# Altium schematic sheet EMG_schemqtic.SchDoc
size 420 x 297 mm; SheetNumber: 1; SheetTotal: 1
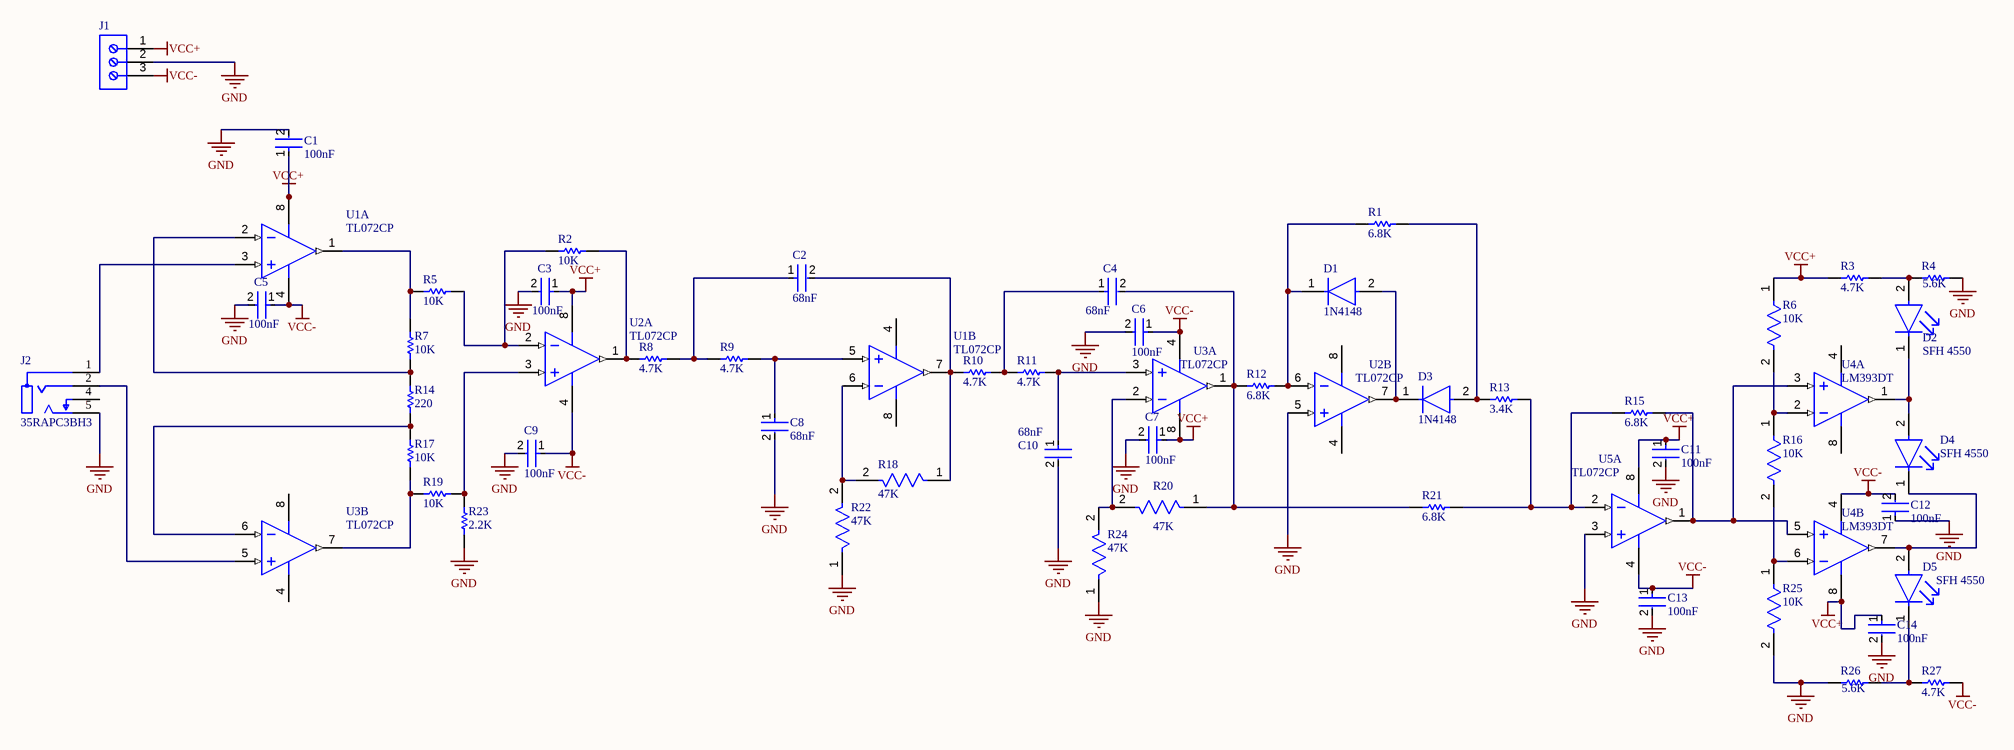
[diagram p0: EMG_schemqtic.SchDoc]

## Parts
C1  100nF  [FP-CGA3E-0_3-0_1-IPC_A]
C2  68nF  [FP-1206-L_3_2_0_2-W_1_6_0-IPC_A]
C3  100nF  [FP-CGA3E-0_3-0_1-IPC_A]
C4  68nF  [FP-1206-L_3_2_0_2-W_1_6_0-IPC_A]
C5  100nF  [FP-CGA3E-0_3-0_1-IPC_A]
C6  100nF  [FP-CGA3E-0_3-0_1-IPC_A]
C7  100nF  [FP-CGA3E-0_3-0_1-IPC_A]
C8  68nF  [FP-1206-L_3_2_0_2-W_1_6_0-IPC_A]
C9  100nF  [FP-CGA3E-0_3-0_1-IPC_A]
C10  68nF  [FP-1206-L_3_2_0_2-W_1_6_0-IPC_A]
C11  100nF  [FP-CGA3E-0_3-0_1-IPC_A]
C12  100nF  [FP-CGA3E-0_3-0_1-IPC_A]
C13  100nF  [FP-CGA3E-0_3-0_1-IPC_A]
C14  100nF  [FP-CGA3E-0_3-0_1-IPC_A]
D1  1N4148  [FP-017AG-MFG]
D2  SFH 4550  [FP-SFH_4550-MFG]
D3  1N4148  [FP-017AG-MFG]
D4  SFH 4550  [FP-SFH_4550-MFG]
D5  SFH 4550  [FP-SFH_4550-MFG]
J1  691709710303  [691709710303]  (value not drawn)
J2  35RAPC3BH3  [FP-35RAPC3BH3-MFG]
R1  6.8K  [RESC1609X50X30LL10T20]
R2  10K  [RESC1609X50X30NL8T20]
R3  4.7K  [RESC2013X70X40NL20T20]
R4  5.6K  [RESC1005X40X25LL05T05]
R5  10K  [RESC1609X50X30NL8T20]
R6  10K  [FP-MCT0603-IPC_C]
R7  10K  [RESC1609X50X30NL8T20]
R8  4.7K  [RESC1005X40X25LL05T05]
R9  4.7K  [RESC1005X40X25LL05T05]
R10  4.7K  [RESC1005X40X25LL05T05]
R11  4.7K  [RESC1005X40X25LL05T05]
R12  6.8K  [RESC1609X50X30LL10T20]
R13  3.4K  [RESC1609X50X30LL10T20]
R14  220  [RESC2013X70X40NL20T20]
R15  6.8K  [RESC1609X50X30LL10T20]
R16  10K  [FP-MCT0603-IPC_C]
R17  10K  [RESC1609X50X30NL8T20]
R18  47K  [FP-CRCW0603-e3-IPC_B]
R19  10K  [RESC1609X50X30NL8T20]
R20  47K  [FP-CRCW0603-e3-IPC_B]
R21  6.8K  [RESC1609X50X30LL10T20]
R22  47K  [FP-CRCW0603-e3-IPC_B]
R23  2.2K  [RESC1608X55X25LL10T15]
R24  47K  [FP-CRCW0603-e3-IPC_B]
R25  10K  [FP-MCT0603-IPC_C]
R26  5.6K  [RESC1005X40X25LL05T05]
R27  4.7K  [RESC2013X70X40NL20T20]
U1  TL072CP  [P0008A]  (parts A,B of 2)
U2  TL072CP  [P0008A]  (parts A,B of 2)
U3  TL072CP  [P0008A]  (parts A,B of 2)
U4  LM393DT  [STM-SO-8_D_L]  (parts A,B of 2)
U5  TL072CP  [P0008A]  (part A of 2)

## Nets
GND: C1.2 C3.2 C5.2 C6.2 C7.2 C8.2 C9.2 C10.2 C11.2 C12.1 C13.2 C14.2 J1.2 J2.5 R4.2 R22.1 R23.1 R24.1 R25.2 R26.1 U2.5(IN2+) U5.3(IN1+)
VCC+: C1.1 C3.1 C7.1 C11.1 C14.1 J1.1 R3.1 R6.1 U1.8(VCC+) U2.8(VCC+) U3.8(VCC+) U4.8(VCC+) U5.8(VCC+)
VCC-: C5.1 C6.1 C9.1 C12.2 C13.1 J1.3 R27.2 U1.4(VCC-) U2.4(VCC-) U3.4(VCC-) U4.4(VCC-) U5.4(VCC-)
NetC2_1: C2.1 R8.2 R9.1
NetC2_2: C2.2 R10.1 R18.1 U1.7(OUT2)
NetC4_1: C4.1 R10.2 R11.1
NetC4_2: C4.2 R12.1 R20.1 R21.1 U3.1(OUT1)
NetC8_1: C8.1 R9.2 U1.5(IN2+)
NetC10_1: C10.1 R11.2 U3.3(IN1+)
NetD1_1: D1.1(C) R1.1 R12.2 U2.6(IN2-)
NetD1_2: D1.2(A) D3.1(C) U2.7(OUT2)
NetD2_1: D2.1(C) D4.2(A) U4.1(OUT1)
NetD2_2: D2.2(A) R3.2 R4.1
NetD3_2: D3.2(A) R1.2 R13.1
NetD4_1: D4.1(C) D5.2(A) U4.7(OUT2)
NetD5_1: D5.1(C) R26.2 R27.1
NetJ2_1: J2.1 U1.3(IN1+)
NetJ2_2: J2.2 U3.5(IN2+)
NetR2_1: R2.1 R8.1 U2.1(OUT1)
NetR2_2: R2.2 R5.1 U2.2(IN1-)
NetR5_2: R5.2 R7.2 U1.1(OUT1)
NetR6_2: R6.2 R16.1 U4.2(IN1-)
NetR7_1: R7.1 R14.2 U1.2(IN1-)
NetR13_2: R13.2 R15.1 R21.2 U5.2(IN1-)
NetR14_1: R14.1 R17.2 U3.6(IN2-)
NetR15_2: R15.2 U4.3(IN1+) U4.5(IN2+) U5.1(OUT1)
NetR16_2: R16.2 R25.1 U4.6(IN2-)
NetR17_1: R17.1 R19.2 U3.7(OUT2)
NetR18_2: R18.2 R22.2 U1.6(IN2-)
NetR19_1: R19.1 R23.2 U2.3(IN1+)
NetR20_2: R20.2 R24.2 U3.2(IN1-)

Not connected (* = marked no-connect by the designer): J2 4

## Notes on the sheet
- THIS DOCUMENT AND THE DATA DISCLOSED HEREIN OR
- HEREWITH IS THE PROPERTY OF ALTIUM LIMITED AND MAY
- DWG NO:
- REVISION
- REV:
- DESCRIPTION
- DATE
- APPROVED
- BE FREELY DISTRIBUTED IN WHOLE. NO RIGHTS ARE
- RESERVED OR EXPRESS OR IMPLIED WARANTEE GIVEN.
- ENG:
- APPROVALS
- PROJECT
- DSN:
- CHK:
- REFERENCE DOCUMENTS
- PROJECT REVISION:
- TITLE
- DOCUMENT REVISION:
- DESIGN ITEM:
- BOM:
- FAB DWG:
- PCB DWG:
- ASSY DWG:
- SCALE:
- A3
- SIZE
- CAGE CODE
- FILE NAME
- DWG NO.
- SHEET
- OF
- REV

## Library data of the parts
C1 C3 C5-C7 C9 C11-C14 = CMP-2000-07546-2: Cap Ceramic 100nF 50V X7R 10% Pad SMD 0603 +125°C Automotive T/R; Weight: 7.1E-05oz; Composition: Ceramic; Max Operating Temperature: 125°C; Termination: SMD/SMT; Dielectric: X7R; Length: 1.6mm; Package Quantity: 1; REACH SVHC: No SVHC; Lead Free: Lead Free; Case Code (Metric): 1608; Min Operating Temperature: -55°C; Packaging: Tape and Reel; Tolerance: 10%; Voltage Rating: 50V; Case Code (Imperial): 0603; Capacitance: 100nF; Case/Package: 0603; Voltage Rating (DC): 50V; Depth: 0.8mm; Radiation Hardening: No; Ratings: AEC-Q200; Mount: Surface Mount; Voltage: 50V; Thickness: 0.035inch; Width: 0.8mm; Height: 0.8mm
C2 C4 C8 C10 = CMP-04427-019044-1: General Purpose Ceramic Capacitor, 1206, 68nF, 10%, X7R, 15%, 100V; Dissipation Factor: 2.5%; Construction: Flat; Packaging: Tape and Reel; Min Operating Temperature: -55°C; Package Quantity: 1; Voltage Rating (DC): 100V; Mount: Surface Mount; RoHS Compliant: Yes; Case/Package: 1206; Thickness: 0.037inch; Case Code (Imperial): 1206; Case Code (Metric): 3216; Max Operating Temperature: 125°C; Depth: 1.6mm; Length: 3.2mm; Series: -; REACH SVHC: No SVHC; Voltage: 100V; Number of Pins: 2; Width: 0.063inch; Voltage Rating: 100V; Capacitance: 68nF; Height: 0.94mm; Radiation Hardening: No; Lead Free: Lead Free; Termination: SMD/SMT; Tolerance: 10%; Dielectric: X7R
D1 D3 = CMP-07163-000046-1: DIODE GEN PURP 100V 200MA DO35; Forward Voltage: 1V; Max Power Dissipation: 500mW; Max Reverse Current: 5uA; Forward Current: 300mA; Current: 4A; Reverse Recovery Time: 4ns; Element Configuration: Single; Outside Diameter: 1.85mm; Capacitance: 4pF; Polarity: Standard; Max Forward Surge Current (Ifsm): 1A; Reverse Voltage: 100V; Output Current: 200mA; Average Rectified Current: 200mA; Diameter: 1.91mm; Max Repetitive Reverse Voltage (Vrrm): 100V; Current Rating: 200mA; Case/Package: DO-35; Lead Free: Lead Free; Number of Pins: 2; Recovery Time: 4ns; Packaging: Bulk; Contact Plating: Tin; Voltage: 100V; Mount: Through Hole; Max Surge Current: 4A; Package Quantity: 2000; Width: 1.91mm; Max Reverse Voltage (DC): 100V; Length: 4.56mm; Radiation Hardening: No; Power Dissipation: 500mW; Voltage Rating (DC): 100V; Peak Non-Repetitive Surge Current: 4A; REACH SVHC: No SVHC; Height: 4.56mm; Max Operating Temperature: 175°C; Series: -; Weight: 0.01lb; Min Operating Temperature: -65°C
D2 D4 D5 = CMP-62016-000011-1: EMITTER IR 860NM 100MA RADIAL; Manufacturer: Osram Opto; Forward Voltage: 1.5V; Reverse Voltage: 5V; Viewing Angle: 6°; Led Orientation: Straight; Colour: Infrared; Mouser Description: Infrared Emitters - High Power Infrared 850 nm HALF ANGLE +/-3DEG; RoHS: TRUE; Manufacturer Part Number: SFH 4550; Forward Current: 100mA; Octopart: https://octopart.com/sfh+4550-osram+opto-55410894; ComponentLink2Description: Datasheet; Lead Free: Yes; Temperature: -40°C to +100°C; ComponentLink2URL: https://dammedia.osram.info/media/resource/hires/osram-dam-5580407/SFH%204550_EN.pdf; Device Class L2: LEDs; Temperature Range Low: -40°C; Digikey Description: EMITTER IR 860NM 100MA RADIAL; Temperature Range High: +100°C; Device Class L3: unset; Peak Emmision Wavelength: 860nm; Category: Diode; Package: SFH 4550; Device Class L1: Optoelectronics; Automotive: No
J1 = CMP-1502-03336-2: Battery connector; NexarPartId: 34171770; Number of Contacts: 3; Voltage Rating: 300V; Connector Type: Screw; Current Rating: 6A; Wire/Cable Gauge: 30AWG; Plating: Steel; Number of Levels: 1; Wire Gauge (Min): 14AWG; Pitch: 5mm; Termination: Screw; Contact Plating: Tin; Max Operating Temperature: 130°C; Color: Black; RoHS: Compliant; Contact Material: Nickel; Number of Pins: 3; Packaging: Digi-Reel®; REACH SVHC: Unknown; Mount: Surface Mount; Lead Pitch: 5mm; Number of Positions Per Level: 3; Flammability Rating: UL94 V-0; Length: 15mm; Number of Positions: 3; Current: 6A; Min Operating Temperature: -40°C; Number of Rows: 1; Wire Gauge (Max): 30AWG; Housing Material: Nylon; Height: 10.2mm; Voltage: 300V
J2 = CMP-47983-000003-1: CONN JACK STEREO 3.5MM R/A; Gender: Female; Number of Positions: 3; Body Color: Black; Number of Ports: 1; Voltage Rating: 500V; Shielding: Unshielded; Body Material: Brass; Orientation: Right Angle; RoHS Compliant: Yes; Termination: Solder; Lead Free: Lead Free; Package Quantity: 1; Series: 35; Housing Material: PBT; Color: Black; Packaging: Bulk; Contact Plating: Silver; Mount: Through Hole; Contact Material: Copper Alloy; Number of Terminals/Pins: 3
R1 R12 R15 R21 = CMP-2000-03550-1: Part Number: CRCW06036K80FKEA; Manufacturer: Vishay Dale
R2 R5 R7 R17 R19 = CMP-1666-00005-4: Chip Resistor, 10 KOhm, +/- 1%, 100 mW, -55 to 155 degC, 0603 (1608 Metric), RoHS, Tape and Reel; Manufacturer: Vishay Semiconductor; Voltage Rating: 75 V; Max Operating Temperature: 155 degC; PackageDescription: 2-Pin Surface Mount Device, Body 1.575 x 0.85 mm; ComponentLink1Description: Manufacturer URL; RoHSCompliant: true; PackageReference: 0603; REACH SVHC: Unknown; Length: 1.55 mm; DatasheetVersion: 06/2012; Packaging: Tape and Reel; Min Operating Temperature: -55 degC; Mounting Technology: Surface Mount; ComponentLink2URL: https://datasheet.ciiva.com/11809/0900766b80d98afc-11809037.pdf; Height: 0.45 mm; ComponentLink2Description: Datasheet; Package Quantity: 5000; ComponentLink1URL: http://www.vishay.com/
R3 R27 = CMP-2001-00550-5: Chip Resistor, 4.7 KOhm, +/- 1%, 0.125 W, -55 to 155 degC, 0805 (2012 Metric), RoHS, Tape and Reel; Manufacturer: Panasonic; Voltage Rating: 150 V; Min Operating Temperature: -55 degC; PackageReference: 0805; Mounting Technology: Surface Mount; Height: 0.6 mm; PackageDescription: 2-Pin Surface Mount Device, Body 2 x 1.25 mm; RoHSCompliant: true; Length: 2 mm; REACH SVHC: Yes; Packaging: Tape and Reel; Pins: 2; Mount: Surface Mount; ComponentLink2Description: Datasheet; ComponentLink1URL: http://www.panasonic.com/; ComponentLink1Description: Manufacturer URL; DatasheetVersion: 04/2015; Package Quantity: 5000; ComponentLink2URL: http://industrial.panasonic.com/cdbs/www-data/pdf/RDA0000/AOA0000C86.pdf; Max Operating Temperature: 155 degC
R4 R26 = CMP-2002-00121-1: Manufacturer: Vishay Dale; Part Number: CRCW04025K60FKED
R6 R16 R25 = CMP-02407-000418-1: RES SMD 100 OHM 1% 1/8W 0603; Voltage Rating: 75V; Power Rating: 100mW; Temperature Coefficient: 50ppm/°C; Max Power Dissipation: 125mW; Resistance: 10kR; Case/Package: 0603; Military Standard: Not; Min Operating Temperature: -55°C; Width: 0.8mm; Package Quantity: 1; Max Operating Temperature: 125°C; Tolerance: 1%; Depth: 0.85mm; Radiation Hardening: No; Mount: Surface Mount; Composition: Thin Film; Contact Plating: Tin; Lead Free: Lead Free; Case Code (Imperial): 0603; Number of Terminations: 2; Voltage Rating (DC): 75V; Length: 1.55mm; Packaging: Tape and Reel; Height: 0.022inch; Case Code (Metric): 1608
R8-R11 = CMP-2002-01154-4: Chip Resistor, 4.7 KOhm, +/- 1%, 0.1 W, -55 to 155 degC, 0402 (1005 Metric), RoHS, Tape and Reel; PartNumber: ERJ-2RKF4701X; Voltage Rating: 50 V; Case\/Package: 0402; Power Rating: 100 mW; Height: 0.35 mm; Mounting Technology: Surface Mount; REACH SVHC: Yes; Resistance: 4.7 KOhm; Max Operating Temperature: 155 degC; ComponentLink1Description: Manufacturer URL; ComponentLink2Description: Datasheet; Pins: 2; PackageReference: 0402; Tolerance: 1%; Case Code (Imperial): 0402; Length: 1 mm; PackageDescription: 2-Pin Surface Mount Device, Body 1 x 0.5 mm; RoHSCompliant: true; Package Quantity: 1; Radiation Hardening: No; DatasheetVersion: 04/2015; Width: 0.5 mm; Case Code (Metric): 1005; Mount: Surface Mount; ComponentLink1URL: http://www.panasonic.com/; Min Operating Temperature: -55 degC; Packaging: Cut Tape; ComponentLink2URL: http://industrial.panasonic.com/cdbs/www-data/pdf/RDA0000/AOA0000C86.pdf
R13 = CMP-2000-03303-1: Manufacturer: Vishay Dale; Part Number: CRCW06033K40FKEA
R14 = CMP-2001-00044-1: Part Number: ERJ6ENF2200V; Manufacturer: Panasonic
R18 R20 R22 R24 = CMP-2000-03379-3: RES SMD 47K OHM 1% 1/10W 0603; Voltage Rating: 75V; Max Power Dissipation: 100mW; Resistance: 47kR; Temperature Coefficient: 100ppm/°C; Size Code: 0603; Technology: THICK FILM; Case Code (Metric): 1608; Radiation Hardening: No; Case/Package: 0603; Number of Terminations: 2; Package Quantity: 5000; Width: 0.85mm; Series: CRCW; RoHS Compliant: Yes; Case Code (Imperial): 0603; Lead Free: Lead Free; Resistance Tolerance: 1%; Depth: 0.85mm; Contact Plating: Tin; Tolerance: 1%; Voltage Rating (DC): 75V; Min Operating Temperature: -55°C; Mount: Surface Mount; Packaging: Tape and Reel; Length: 1.55mm; Resistor Type: Thick Film; Features: Automotive AEC-Q200; Max Operating Temperature: 155°C; Weight: 7.1E-05oz; Construction: Rectangular; Height: 0.45mm; Military Standard: Not; Termination: SMD/SMT; Power Rating: 100mW
R23 = CMP-2000-06934-1: Thick Film Resistor, 2.2 KOhm, 100 mW, 50 V, +/- 1%, -55 to 155 degC, 2-Pin SMD (0603), RoHS, Tape and Reel; Manufacturer: Yageo; Resistance: 2.2kOhms; Temperature Coefficient: 100PPM/C; Voltage Rating: 50V; Power Rating: 100mW; Tolerance: 1%; Datasheet Version: Rev. 7, 05/2017; Case Code - mm: 1608; Series: RC; Mounting Technology: SurfaceMount; Package Description: 2-Pin Surface Mount Device, Body 1.6 x 0.8 mm; Case Code - in: 0603; Package Reference: 0603; Product: ThickFilmResistorsGeneralPurpose; Manufacturer URL: http://www.yageo.com/; Termination Style: SMD/SMT; Operating Temperature Range: -55Cto+155C; Datasheet URL: http://www.yageo.com/documents/recent/PYu-RC_Group_51_RoHS_L_7.pdf; Packaging: Reel
U1-U3 U5 = CMP-0017-00950-2: Dual Low-Noise JFET-Input General-Purpose Operational Amplifier, 7 to 36 V, 0 to 70 degC, 8-pin DIP (P8), Pb-Free (RoHS); Manufacturer: Texas Instruments; Sub Family: General Purpose Amplifier, High Supply Voltage Amplifier (>=30V); Total Supply Voltage(Max)(+5V is 5, +/-5V is 10): 36; Slew Rate(Typ)(V/us): 13; Vn at 1kHz(Typ)(nV/rtHz): 18; GBW(Typ)(MHz): 3; CMRR(Min)(dB): 70; Total Supply Voltage(Min)(+5V is 5, +/-5V is 10): 7; Vio (25C)(Max)(mV): 10; Rating: Catalog; IIB(Max)(pA): 200; Iq per channel(Max)(mA): 2.5; Number of Channels: 2; Mounting Technology: Through Hole; ComponentLink3Description: Package Specification; PartNumber: TL072CP; PackageVersion: 4040082/E, 04/2010; Eco-Plan: Pb-Free (RoHS); DatasheetVersion: SLOS080J; Offset Drift(Typ)(uV/C): 18; ComponentLink3URL: http://www.ti.com/litv/pdf/mpdi001b; PackageDescription: 8-Pin Plastic In-Line, Body 9.59 x 6.35 mm, Pitch 2.54 mm; Code_JEDEC: MS-001; ComponentLink2URL: http://www.ti.com/lit/ds/symlink/tl072.pdf; ComponentLink1Description: Manufacturer URL; ComponentLink2Description: Datasheet; ComponentLink1URL: http://www.ti.com/; PackageReference: P0008A
U4 = CMP-2000-06550-1: Low-Power, Dual-Voltage Comparator, 2 to 36 V, 0 to 70 degC, 8-Pin SOIC (SO), RoHS, Tape and Reel; Manufacturer: STMicroelectronics; Voltage - Supply, Single/Dual (±): 2V~36V,±1V~18V; Current - Input Bias (Max): 0.25µA@5V; Number of Elements: 2; Current - Output (Typ): 18mA@5V; Other Names: 497-1593-2; Voltage - Input Offset (Max): 5mV@30V; Output Type: CMOS,DTL,ECL,MOS,Open-Collector,TTL; EDA / CAD Models: DownloadfromAcceleratedDesigns; Other Related Documents: LM393ViewAllSpecificationsLM393ViewAllSpecifications; Online Catalog: Comparators-2elements; Current - Quiescent (Max): 2.5mA; Standard Package: 2,500; Manufacturer URL: http://www.st.com/; Package Description: 8-Pin Small Outline Integrated Circuit, Body 4.9 x 3.9 mm, Pitch 1.27 mm; Packaging: Tape&Reel(TR); Datasheet Version: Rev. 15, 02/2016; Category: IntegratedCircuits(ICs); Operating Temperature: 0°C~70°C; Mounting Type: SurfaceMount; Supplier Device Package: 8-SO; Datasheet URL: http://www.st.com/content/ccc/resource/technical/document/datasheet/group1/b4/cc/cf/13/18/28/44/f5/CD00000465/files/CD00000465.pdf/jcr:content/translations/en.CD00000465.pdf; Family: Linear-Comparators; Mounting Technology: SurfaceMount; Type: GeneralPurpose; Package Reference: SO-8; Package / Case: 8-SOIC(0.154",3.90mmWidth)